# EAGLE design smt_isp_adapter_right-handed (EAGLE 6.5.0)
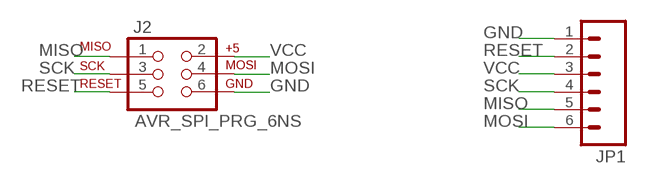
[diagram p0: schematic, sheet 1]

## Parts
J2  AVR_SPI_PRG_6NS  [2X3-NS]
JP1  M06LONGPADS  [1X06_LONGPADS]

## Nets
GND: J2.6 JP1.1
MISO: J2.1 JP1.5
MOSI: J2.4 JP1.6
RESET: J2.5 JP1.2
SCK: J2.3 JP1.4
VCC: J2.2 JP1.3

## Library data of the parts
J2 = SparkFun-Connectors:AVR_SPI_PRG_6: AVR ISP 6 Pin This is the reduced ISP connector for AVR programming. Common on Arduino. This footprint will take up less PCB space and can be used with a 10-pin to 6-pin adapter such as SKU: BOB-08508
JP1 = SparkFun-Connectors:M06: Header 6 Standard 6-pin 0.1" header. Use with straight break away headers (SKU : PRT-00116), right angle break away headers (PRT-00553), swiss pins (PRT-00743), machine pins (PRT-00117), and female headers (PRT-00115). Molex polarized connector foot print use with SKU : PRT-08094 with associated crimp pins and housings. NOTES ON THE VARIANTS LOCK and LOCK_LONGPADS... This footprint was designed to help hold the alignment of a through-hole component (i.e. 6-pin header) while soldering it into place. You may notice that each hole has been shifted either up or down by 0.005 of an inch from it's more standard position (which is a perfectly straight line). This slight alteration caused the pins (the squares in the middle) to touch the edges of the holes. Because they are alternating, it causes a "brace" to hold the component in place. 0.005 has proven to be the perfect amount of "off-center" position when using our standard breakaway headers. Although looks a little odd when you look at the bare footprint, once you have a header in there, the alteration is very hard to notice. Also,if you push a header all the way into place, it is covered up entirely on the bottom side. This idea of altering the position of holes to aid alignment will be further integrated into the Sparkfun Library for other footprints. It can help hold any component with 3 or more connection pins.

## Board
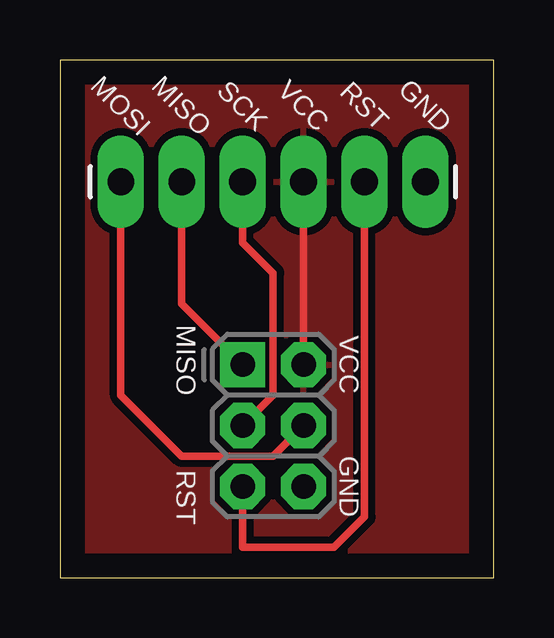
[diagram p1: board, top side]
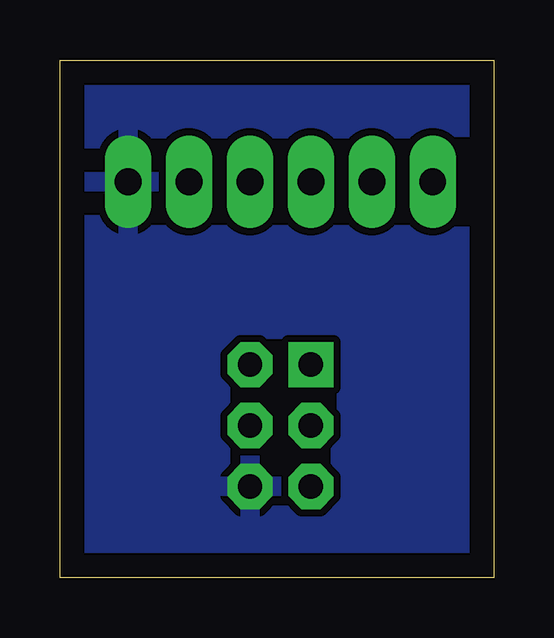
[diagram p2: board, bottom side, seen from below]

Size 18.09 x 21.58 mm. Coordinates in mm from the lower left corner, seen from the top.
Outline: 0,0 18.09,0 18.09,21.58 0,21.58 0,0
Copper layers (1*16): Top 0.035mm / dielectric 1.5mm / Bottom 0.035mm
Design rules "improved_12mil": minimum track width 12mil, minimum drill 0.8mm, track to track 12mil, track to pad 12mil, pad to pad 12mil, via to via 12mil, smd to smd 12mil, copper to edge 40mil, drill to drill 12mil, minimum pad ring 16mil, minimum via ring 16mil, stop-mask expansion 4mil, vias tented up to drill 0mil, thermal gap 12mil

### Footprints (pad centres in the part's own frame; a part is rotated, then mirrored left to right if it is on the bottom)
2X3-NS = drill 1.016 pad 1.88 square: 1 -2.54,-1.27 | drill 1.016 pad 1.88 octagon: 2 -2.54,1.27; 3 0,-1.27; 4 0,1.27; 5 2.54,-1.27; 6 2.54,1.27
1X06_LONGPADS = drill 1.118 pad 1.88 long: 1 0,0; 2 2.54,0; 3 5.08,0; 4 7.62,0; 5 10.16,0; 6 12.7,0

### Placement (x,y rotation side)
J2  8.89,6.35 270 top
JP1  15.24,16.51 180 top

### Tracks (layer width: path | path; a pad name or v marks a point on that pad's centre or on a via)
GND
  pour Bottom: 0,21.59 0,0 17.78,0 17.78,21.59
MISO
  Top 0.305: J2.1 5.08,11.43 JP1.5
MOSI
  Top 0.305: J2.4 8.89,5.08 5.08,5.08 2.54,7.62 JP1.6
RESET
  Top 0.305: J2.5 7.62,1.27 11.43,1.27 12.7,2.54 JP1.2
SCK
  Top 0.305: J2.3 8.89,7.62 8.89,12.7 7.62,13.97 JP1.4
VCC
  Top 0.305: J2.2 JP1.3
  pour Top: 0,21.59 0,0 17.78,0 17.78,21.59

### Text on the board
tNames: MOSI | MISO | SCK | VCC | RST | GND | MISO | VCC | GND | RST